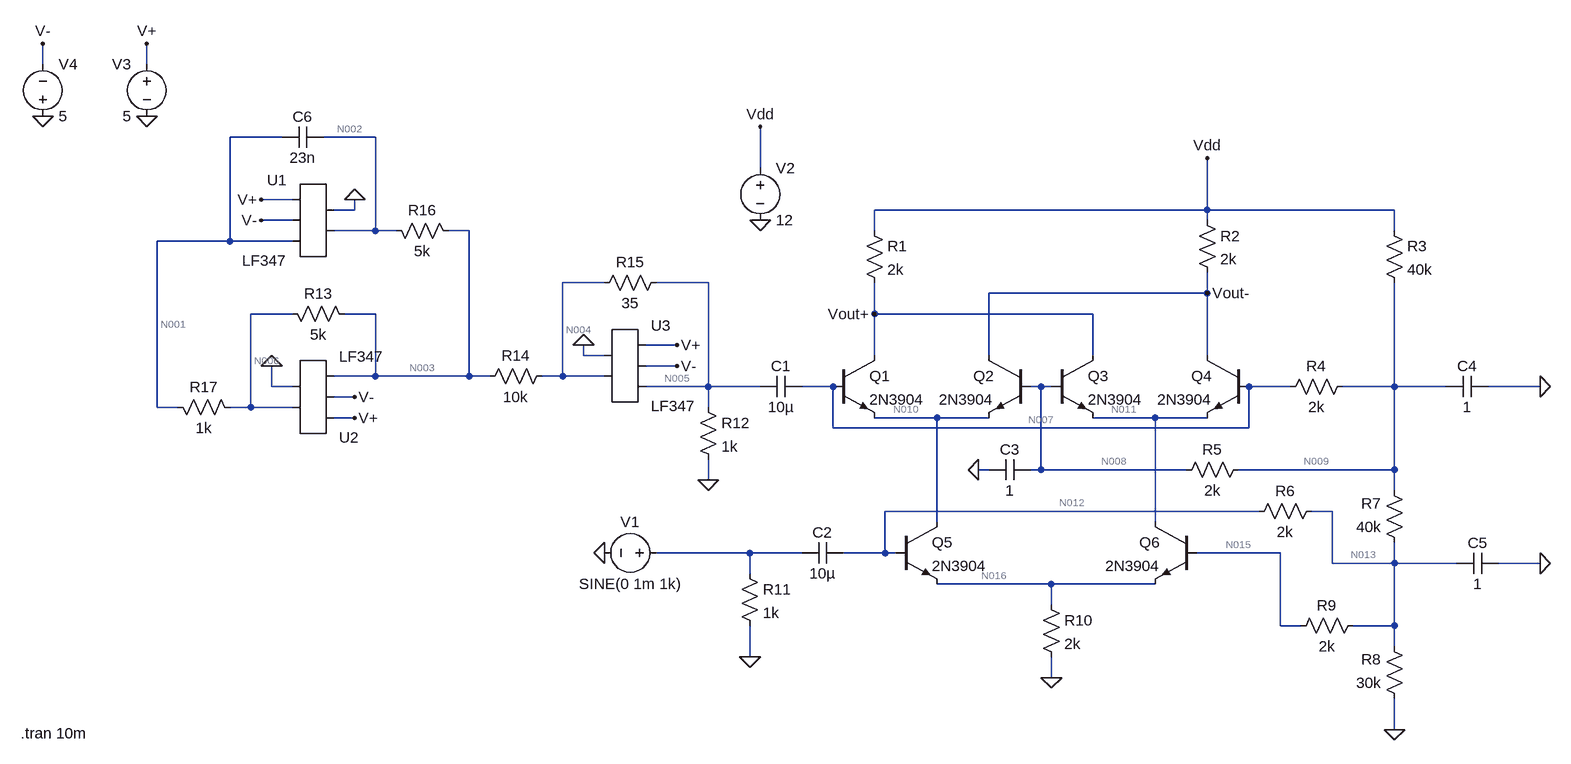
[diagram p0: schematic q_1.asc]
* q_1.asc
Q1 Vout+ N007 N010 0 2N3904
Q2 Vout- N008 N010 0 2N3904
Q3 Vout+ N008 N011 0 2N3904
Q4 Vout- N007 N011 0 2N3904
Q5 N010 N012 N016 0 2N3904
Q6 N011 N015 N016 0 2N3904
V1 N014 0 SINE(0 1m 1k)
R1 Vdd Vout+ 2k
R2 Vdd Vout- 2k
R3 Vdd N009 40k
R4 N009 N007 2k
R5 N009 N008 2k
R6 N013 N012 2k
R7 N013 N009 40k
R8 0 N013 30k
R9 N015 N013 2k
R10 N016 0 2k
R11 N014 0 1k
R12 N005 0 1k
C1 N007 N005 10µ
C2 N012 N014 10µ
C3 N008 0 1
C4 0 N009 1
C5 0 N013 1
V2 Vdd 0 12
* U1: LF347 (symbol AutoGenerated\LF347 not available, pins judged from their places): pin1=0 pin2=N002 pin3=V+ pin4=V- pin5=N001
V3 V+ 0 5
V4 0 V- 5
* U2: LF347 (symbol AutoGenerated\LF347 not available, pins judged from their places): pin1=N006 pin2=0 pin3=V+ pin4=V- pin5=N003
R16 N002 N003 5k
R17 N001 N006 1k
R13 N006 N003 5k
C6 N001 N002 23n
* U3: LF347 (symbol AutoGenerated\LF347 not available, pins judged from their places): pin1=0 pin2=N004 pin3=V+ pin4=V- pin5=N005
R14 N004 N003 10k
R15 N005 N004 35
.model NPN NPN
.model PNP PNP
.lib standard.bjt
.tran 10m
.backanno
.end

* Results of the author's LTspice run, read from the files saved beside the schematic
* Operating Point, zero values left out:
*   V(vout+) = 10.76 V
*   V(n007) = 7.487 V
*   V(n010) = 6.863 V
*   V(vout-) = 10.76 V
*   V(n008) = 7.487 V
*   V(n011) = 6.863 V
*   V(n012) = 3.138 V
*   V(n016) = 2.496 V
*   V(n015) = 3.138 V
*   V(vdd) = 12 V
*   V(n009) = 7.491 V
*   V(n013) = 3.142 V
*   V(n005) = 1.866 µV
*   V(n001) = -2.611 µV
*   V(v-) = -5 V
*   V(v+) = 5 V
*   V(n002) = 1.865 µV
*   V(n003) = 2.14 µV
*   V(n006) = -1.865 µV
*   V(n004) = 1.865 µV
*   Ic(Q6) = 621.9 µA
*   Ib(Q6) = 2.002 µA
*   Ie(Q6) = -623.9 µA
*   Ic(Q5) = 621.9 µA
*   Ib(Q5) = 2.002 µA
*   Ie(Q5) = -623.9 µA
*   Ic(Q4) = 310 µA
*   Ib(Q4) = 1.001 µA
*   Ie(Q4) = -311 µA
*   Ic(Q3) = 310 µA
*   Ib(Q3) = 1.001 µA
*   Ie(Q3) = -311 µA
*   Ic(Q2) = 310 µA
*   Ib(Q2) = 1.001 µA
*   Ie(Q2) = -311 µA
*   Ic(Q1) = 310 µA
*   Ib(Q1) = 1.001 µA
*   Ie(Q1) = -311 µA
*   I(C5) = -3.142 pA
*   I(C4) = -7.491 pA
*   I(C3) = 7.487 pA
*   I(R15) = 27.5 pA
*   I(R14) = -27.51 pA
*   I(R13) = -800.9 pA
*   I(R17) = -745.9 pA
*   I(R16) = -55.01 pA
*   I(R12) = 1.866 nA
*   I(R10) = 1.248 mA
*   I(R9) = -2.002 µA
*   I(R8) = -104.7 µA
*   I(R7) = -108.7 µA
*   I(R6) = 2.002 µA
*   I(R5) = 2.002 µA
*   I(R4) = 2.002 µA
*   I(R3) = 112.7 µA
*   I(R2) = 619.9 µA
*   I(R1) = 619.9 µA
*   I(V4) = -2.586 mA
*   I(V3) = -2.585 mA
*   I(V2) = -1.353 mA
*   Ix(u1:1) = 55.01 pA
*   Ix(u1:2) = 55.01 pA
*   Ix(u1:3) = 861.7 µA
*   Ix(u1:4) = -862 µA
*   Ix(u1:5) = 745.9 pA
*   Ix(u2:1) = 55.01 pA
*   Ix(u2:2) = 55.01 pA
*   Ix(u2:3) = 861.7 µA
*   Ix(u2:4) = -862 µA
*   Ix(u2:5) = -883.4 pA
*   Ix(u3:1) = 55.01 pA
*   Ix(u3:2) = 55.01 pA
*   Ix(u3:3) = 861.7 µA
*   Ix(u3:4) = -862 µA
*   Ix(u3:5) = -1.893 nA
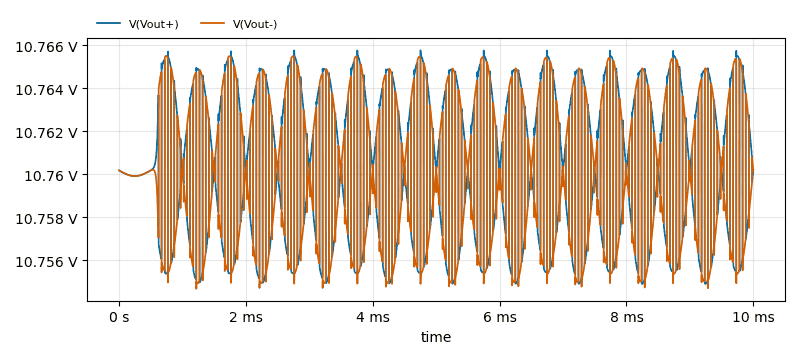
[diagram p1: Transient Analysis of q_1.asc, plotted from the saved traces]
* Transient Analysis, 1 run:
*   V(Vout+): min 10.75 V, max 10.77 V, average 10.76 V, rms 10.76 V, last 10.76 V
*   V(Vout-): min 10.75 V, max 10.77 V, average 10.76 V, rms 10.76 V, last 10.76 V